# EAGLE board EBot4_v_12 (EAGLE 7.7.0)
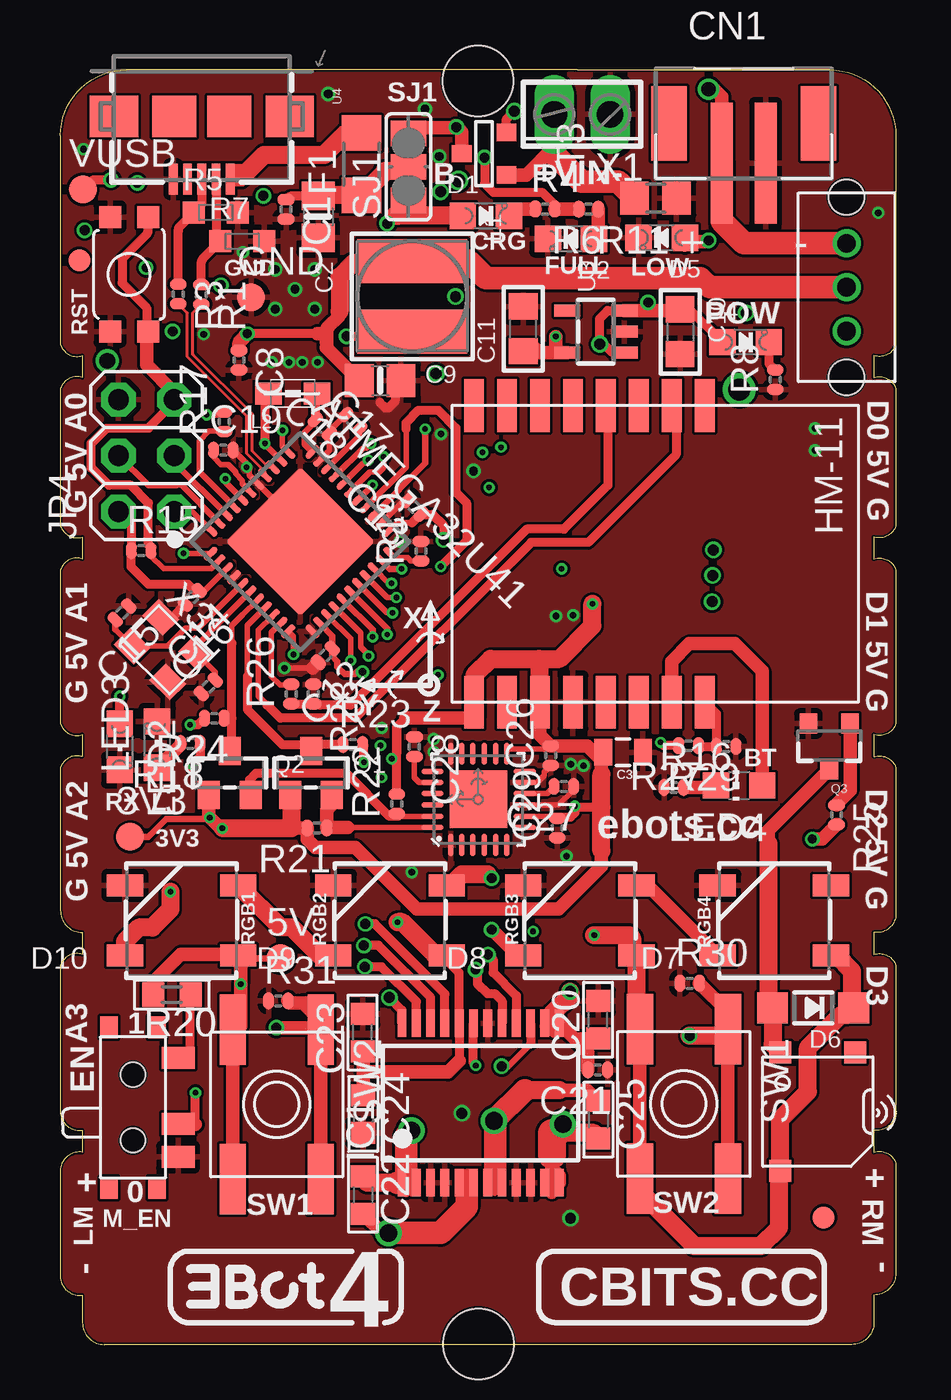
[diagram p4: board, top side]
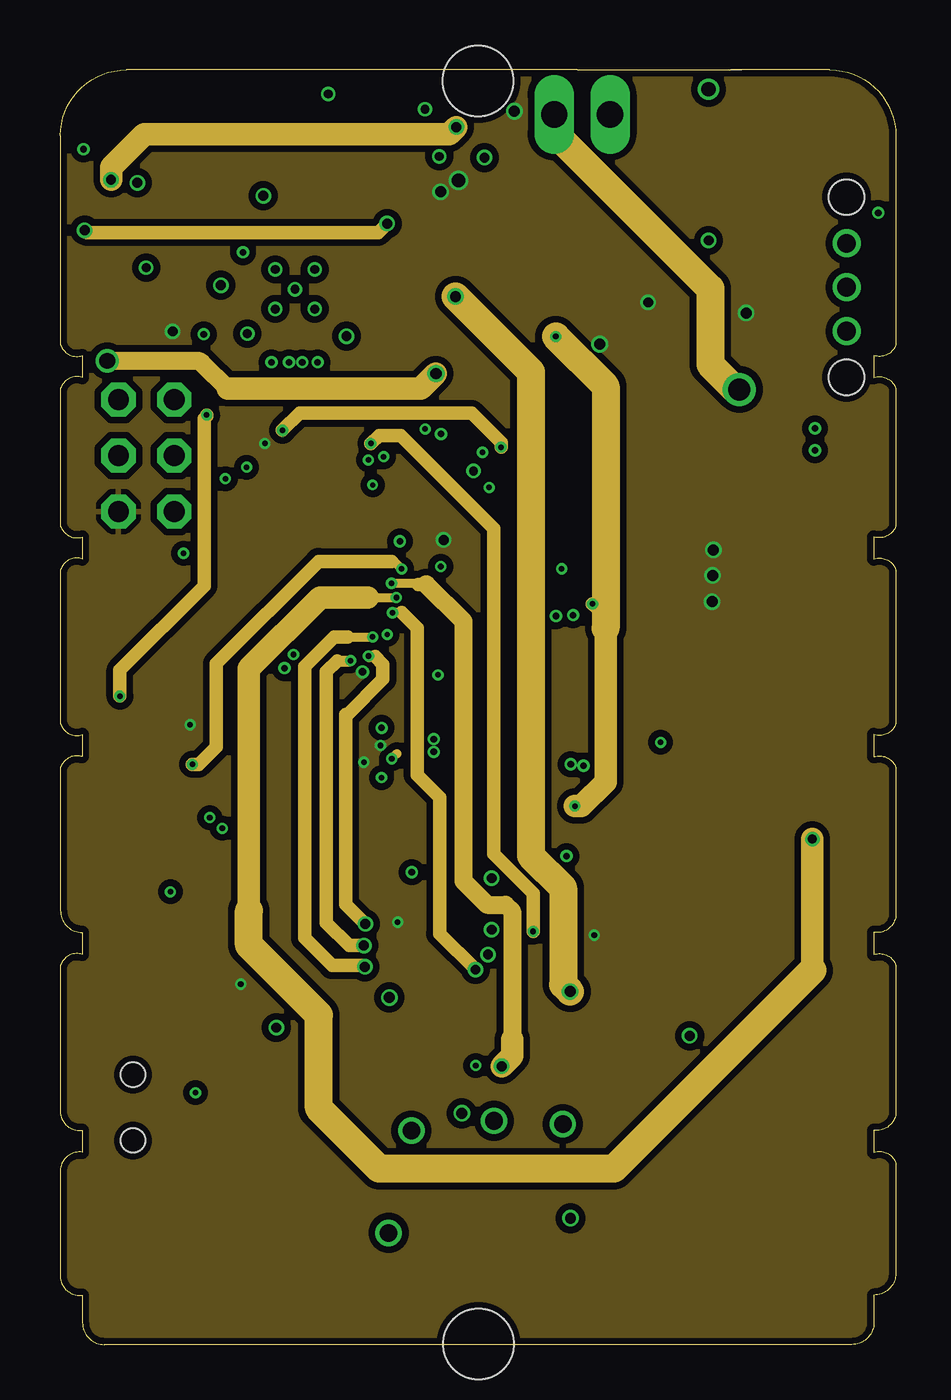
[diagram p5: board, inner layer Route2]
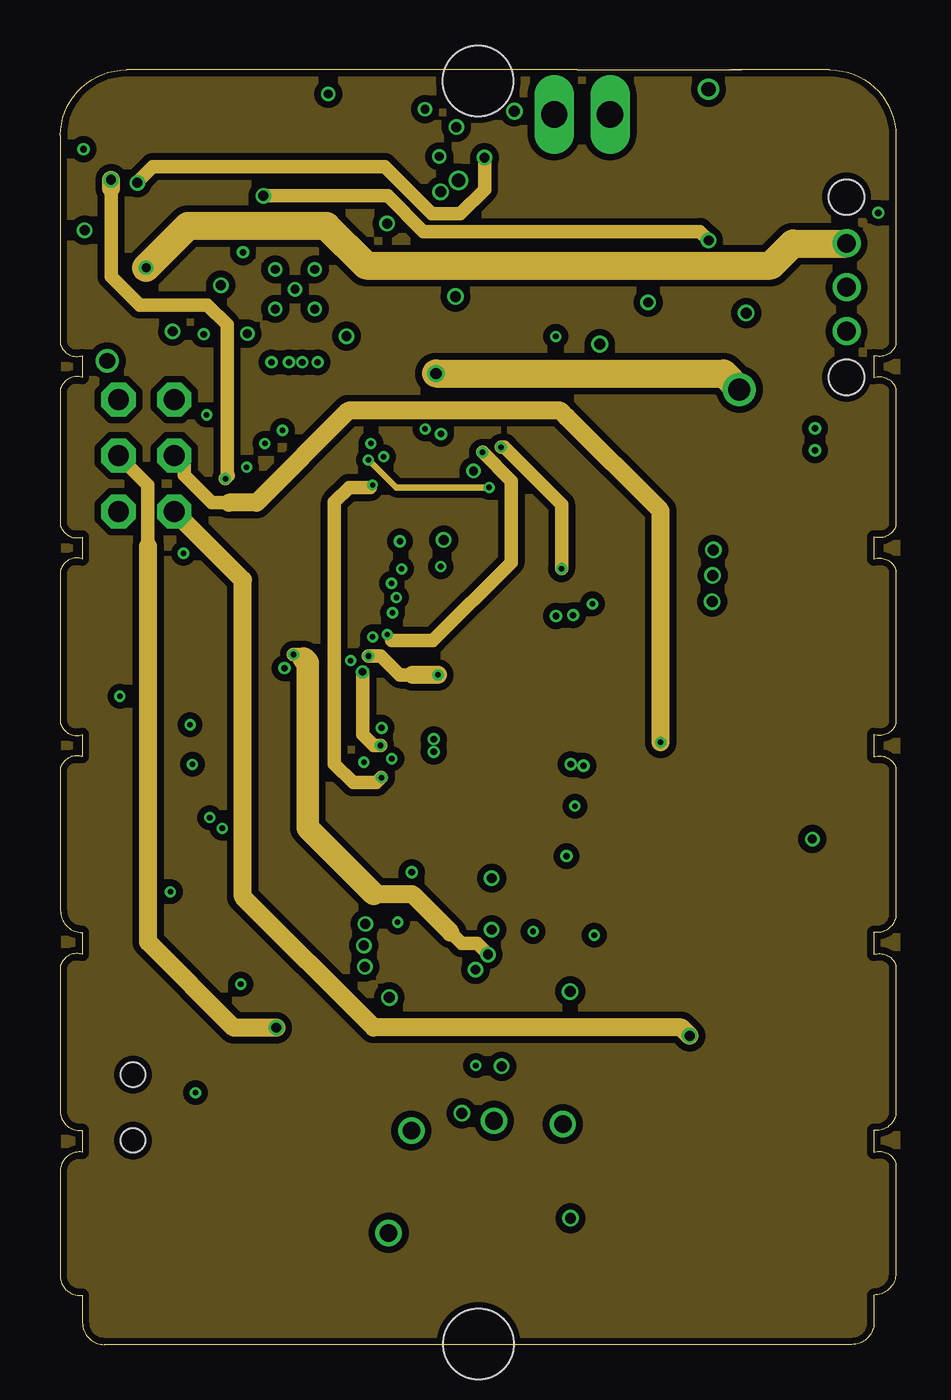
[diagram p6: board, inner layer Route15]
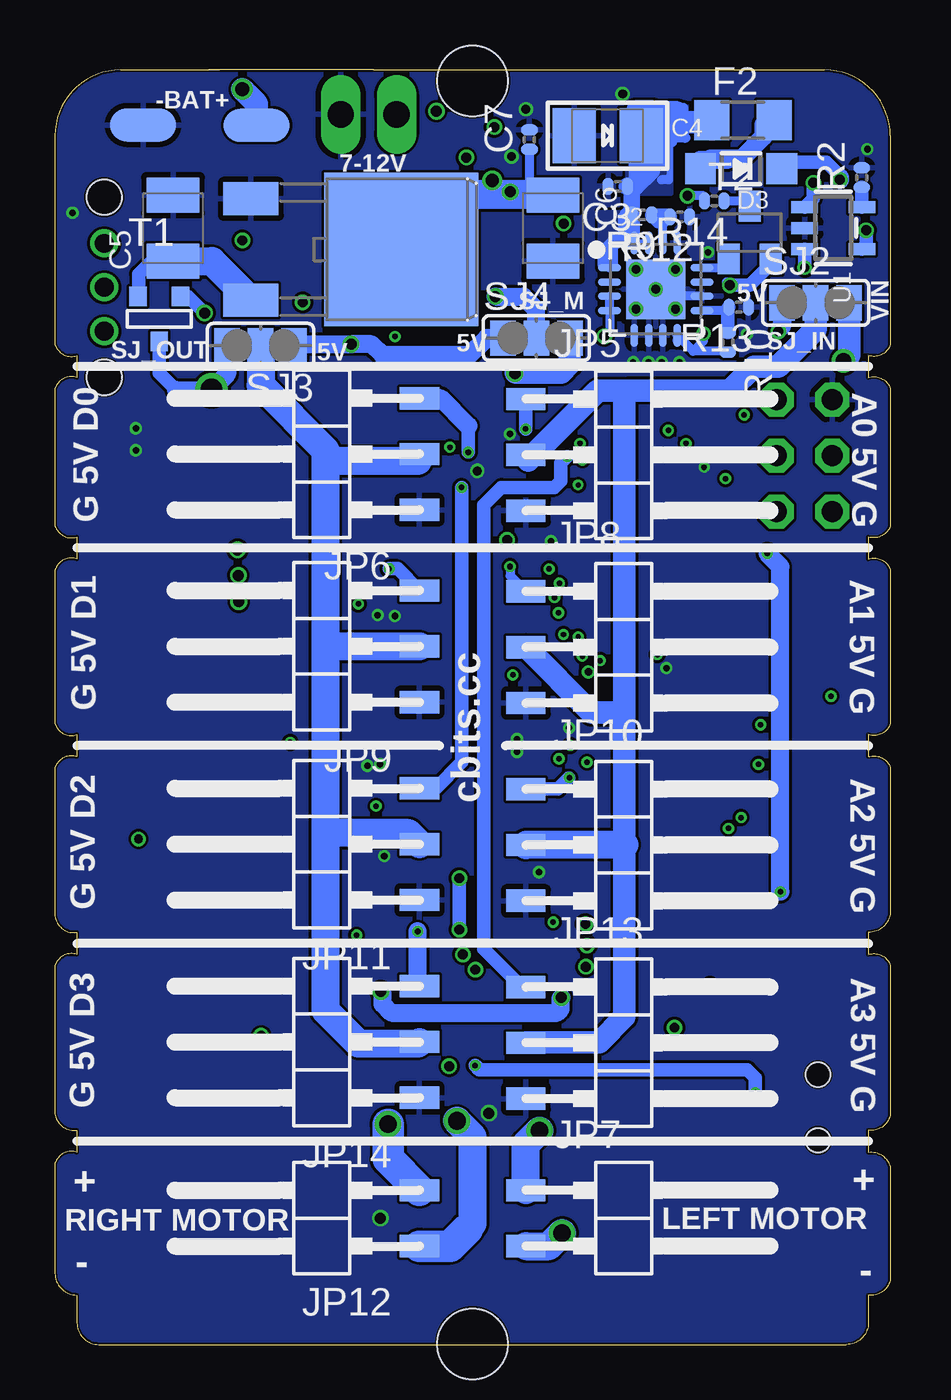
[diagram p7: board, bottom side, seen from below]

Size 38 x 58 mm. Coordinates in mm from the lower left corner, seen from the top.
Outline: 31,58 35,58 arc-90 38,55 38,45.5 arc-90 37,45 37,44 arc-90 38,43.5 38,37.25 arc-90 37,36.75 37,35.75 arc-90 38,35.25 38,28.25 arc-90 37,27.75 37,26.75 arc-90 38,26.25 38,19.5 arc-90 37,18.75 37,17.75 arc-90 38,17.25 38,10.5 arc-90 37,9.75 37,8.75 arc-90 38,8.25 38,3.25 arc-90 37,2.25 37,1 arc-90 36,0 2,0 arc-90 1,1 1,2.25 arc-90 0,3 0,8 arc-90 1,8.75 1,9.75 arc-90 0,10.5 0,17.25 arc-90 1,17.75 1,18.75 arc-90 0,19.75 0,26.25 arc-90 1,26.75 1,27.75 arc-90 0,28.25 0,35.25 arc-90 1,35.75 1,36.75 arc-90 0,37.25 0,43.5 arc-90 1,44 1,45 arc-90 0,45.5 0,55 arc-90 3,58 23.5,58 31,58
Outline: 31,58 30.5,58
Copper layers (1*2*15*16): Top 0.035559375mm / dielectric 0.47751875mm / Route2 0.035559375mm / dielectric 0.47751875mm / Route15 0.035559375mm / dielectric 0.47751875mm / Bottom 0.035559375mm
Design rules "SparkFun-4-layer-FAB-LIMIT *": minimum track width 4mil, minimum drill 6mil, track to track 5mil, track to pad 5mil, pad to pad 5mil, via to via 5mil, smd to smd 5mil, copper to edge 4mil, drill to drill 4mil, minimum pad ring 5mil, minimum via ring 5mil, stop-mask expansion 4mil, vias tented up to drill 21mil, thermal gap 10mil
Holes 3.2 mm at 19,57.5 19.01,0.03

## Footprints (pad centres in the part's own frame; a part is rotated, then mirrored left to right if it is on the bottom)
B1,27 = smd 1.27 x 1.27: TP 0,0
QFN44ML7X7 = smd 0.75 x 0.275: 1 -3.275,2.5; 2 -3.275,2; 3 -3.275,1.5; 4 -3.275,1; 5 -3.275,0.5; 6 -3.275,0; 7 -3.275,-0.5; 8 -3.275,-1; 9 -3.275,-1.5; 10 -3.275,-2; 11 -3.275,-2.5; 23 3.275,-2.5; 24 3.275,-2; 25 3.275,-1.5; 26 3.275,-1; 27 3.275,-0.5; 28 3.275,0; 29 3.275,0.5; 30 3.275,1; 31 3.275,1.5; 32 3.275,2; 33 3.275,2.5 | smd 0.275 x 0.75: 12 -2.5,-3.275; 13 -2,-3.275; 14 -1.5,-3.275; 15 -1,-3.275; 16 -0.5,-3.275; 17 0,-3.275; 18 0.5,-3.275; 19 1,-3.275; 20 1.5,-3.275; 21 2,-3.275; 22 2.5,-3.275; 34 2.5,3.275; 35 2,3.275; 36 1.5,3.275; 37 1,3.275; 38 0.5,3.275; 39 0,3.275; 40 -0.5,3.275; 41 -1,3.275; 42 -1.5,3.275; 43 -2,3.275; 44 -2.5,3.275 | smd 4.826 x 4.826: EXP 0,0
AZ1084C = smd 1.5 x 2.5: GND -2.3,-6.85; VIN 2.3,-6.85 | smd 7 x 7: VOUT 0,0
C0402 = smd 0.508 x 0.762: 1 -0.445,0; 2 0.445,0
0805-NO = smd 1.3 x 1.5: 1 -0.95,0; 2 0.95,0
EIA3528-21/B-R = smd 1.95 x 2.5: + 1.525,0; - -1.525,0
SMC_B = smd 1.6 x 2.4: + -1.5,0; - 1.5,0
_0805 = smd 1.2 x 1.3: 1 -1.016,0; 2 1.016,0
C0603 = smd 1 x 1.1: 1 -0.85,0; 2 0.85,0
0805 = smd 0.8 x 1.2: 1 -0.9,0; 2 0.9,0
JST-PH-2-SMT = smd 1 x 5.5: 1 -1,-1.8; 2 1,-1.8 | smd 1.6 x 3.4: NC1 -3.4,0; NC2 3.4,0
CHIPLED_0805_NOOUTLINE = smd 1.2 x 1.2: A 0,-1.05; C 0,1.05
SOD-123 = smd 1.4 x 1.4: A 1.85,0; C -1.85,0
WS2812B = smd 1.651 x 1: 1 -2.577,1.6; 2 -2.577,-1.6; 3 2.577,-1.6; 4 2.577,1.6
R1206 = smd 1.6 x 1.803: 1 -1.422,0; 2 1.422,0
HM-11 = smd 2.4 x 0.9: GND 6.5,0; NC@5 -7,0; NC@6 -7,-1.5; NC@7 -7,-3; NC@8 -7,-4.5; NC@10 6.5,-3; PIO0 6.5,6; PIO1 6.5,4.5; PIO2 6.5,3; PIO3 6.5,1.5; RESETB 6.5,-1.5; UART_CTS -7,3; UART_RTS -7,6; UART_RX -7,1.5; UART_TX -7,4.5; VCC 6.5,-4.5
SSOP24 = smd 0.4 x 1.25: 1 -3.575,-3.625; 2 -2.925,-3.625; 3 -2.275,-3.625; 4 -1.625,-3.625; 5 -0.975,-3.625; 6 -0.325,-3.625; 7 0.325,-3.625; 8 0.975,-3.625; 9 1.625,-3.625; 10 2.275,-3.625; 11 2.925,-3.625; 12 3.575,-3.625; 13 3.575,3.625; 14 2.925,3.625; 15 2.275,3.625; 16 1.625,3.625; 17 0.975,3.625; 18 0.325,3.625; 19 -0.325,3.625; 20 -0.975,3.625; 21 -1.625,3.625; 22 -2.275,3.625; 23 -2.925,3.625; 24 -3.575,3.625
FIDUCIAL-1X2 = smd 1 x 1: 1 0,0
2X03 = drill 0.95 pad 1.55 octagon: 1 -2.54,-1.27; 2 -2.54,1.27; 3 0,-1.27; 4 0,1.27; 5 2.54,-1.27; 6 2.54,1.27
1X03SMD/90 = smd 1.016 x 1.778: 1 -1.27,-5.08; 2 1.27,-5.08; 3 3.81,-5.08
1X02SMD/90 = smd 1.016 x 1.778: 1 -1.27,-5.08; 2 1.27,-5.08
KMR7 = smd 1 x 1: P$1 -2.6,-0.865; P$2 2.6,-0.865; P$3 -2.6,0.865; P$4 2.6,0.865
INDUCTOR_5X5MM_TDK_VLC5045 = smd 2 x 5: P$1 -1.6,0; P$2 1.6,0
0805' = smd 1.2 x 1: 1 -1.1,0; 2 1.1,0
CHIPLED_0805 = smd 1.2 x 1.2: A 0,-1.05; C 0,1.05
CHIP-LED0805 = smd 1.2 x 1.2: A 0,-1.05; C 0,1.05
QFN-24-4MM2 = smd 1.016 x 0.254: 1 -2.066,1.257; 2 -2.066,0.75; 3 -2.066,0.247; 4 -2.066,-0.287; 5 -2.066,-0.792; 6 -2.066,-1.297; 13 2.086,-1.297; 14 2.086,-0.792; 15 2.086,-0.287; 16 2.086,0.247; 17 2.086,0.75; 18 2.086,1.257 | smd 0.254 x 1.016: 7 -1.267,-2.122; 8 -0.762,-2.122; 9 -0.258,-2.122; 10 0.278,-2.122; 11 0.78,-2.122; 12 1.287,-2.122; 19 1.287,2.082; 20 0.78,2.082; 21 0.278,2.082; 22 -0.258,2.082; 23 -0.762,2.082; 24 -1.267,2.082 | smd 2.616 x 2.616: P$1 0.02,-0.01
OS102011MA1QN1 = drill 0.85: P$1 -2,0; P$2 0,0; P$3 2,0 | hole 1.6: -4.1,0; 4.1,0
SOT23-WIDE@1 = smd 1 x 1.27: 1 -0.95,-1; 2 0.95,-1; 3 0,1
SOT23-3 = smd 0.8 x 0.9: 1 -0.95,-1; 2 0.95,-1; 3 0,1.1
R0402 = smd 0.508 x 0.762: 1 -0.445,0; 2 0.445,0
CT/CN0603 = smd 1 x 1: 1 -1,0; 2 1,0
R0805 = smd 1.3 x 1.5: 1 -0.95,0; 2 0.95,0
R0603 = smd 1 x 1.1: 1 -0.85,0; 2 0.85,0
SJ_2 = smd 1.168 x 1.6: 1 -1.524,0; 2 0,0; 3 1.524,0
SK-12C0405 = smd 1 x 1.5: L -2.25,2.05; M 0.75,2.05; R 2.25,2.05 | smd 1 x 0.8: P$1 -3.65,-1.1; P$2 -3.65,1.1; P$3 3.65,-1.1; P$4 3.65,1.1 | hole 1.1: -1.5,0; 1.5,0
SMT-0540-S-R = smd 1 x 1: + 1.7,-2.7; - 1.7,2.7; M -1.7,-2.7
EVQ-Q2 = smd 3.2 x 1.2: A -3.4,-2; A' 3.4,-2; B -3.4,2; B' 3.4,2
SOT-23 = smd 0.787 x 0.889: 1 0.025,-1.016; 2 -0.94,1.016; 3 0.991,1.016
SC59-BEC = smd 1 x 1.4: B -0.95,-1.2; C 0,1.2; E 0.95,-1.2
SOT23-5 = smd 0.55 x 1.2: 1 -0.95,-1.3; 2 0,-1.3; 3 0.95,-1.3; 4 0.95,1.3; 5 -0.95,1.3
PVQFN-16 = smd 1.05 x 0.35: 1 -2.1,0.975; 2 -2.1,0.325; 3 -2.1,-0.325; 4 -2.1,-0.975; 9 2.1,-0.975; 10 2.1,-0.325; 11 2.1,0.325; 12 2.1,0.975 | smd 0.35 x 1.05: 5 -0.975,-2.1; 6 -0.325,-2.1; 7 0.325,-2.1; 8 0.975,-2.1; 13 0.975,2.1; 14 0.325,2.1; 15 -0.325,2.1; 16 -0.975,2.1 | drill 0.4: P$18 0,0; P$19 -0.9,0.9; P$20 0.9,0.9; P$21 0.9,-0.9; P$22 -0.9,-0.9 | smd 2.7 x 2.7: THERMAL 0,0
SOT23-5@1 = smd 0.55 x 1.2: 1 -0.95,-1.3; 2 0,-1.3; 3 0.95,-1.3; 4 0.95,1.3; 5 -0.95,1.3
USB-AB-MICRO-SMD = smd 1.4 x 0.4: D+ 2.85,0; D- 2.85,0.65; GND 2.85,-1.3; ID 2.85,-0.65; VBUS 2.85,1.3 | smd 1.9 x 2: P$6 0,1.25; P$7 0,-1.25 | smd 1.9 x 2.2: P$8 0,4; P$9 0,-4
BATCON = smd 3 x 1.5: P$1 0,0
2POL254 = drill 1.2 long: 1 -1.27,0; 2 1.27,0
CRYSTAL-3.2-2.5 = smd 1.3 x 1.05: 1 -1.15,-0.925; 2 1.15,-0.925; 3 1.15,0.925; 4 -1.15,0.925

## Placement (x,y rotation side)
3V3  TPB1,27  [B1,27]  3.17,23.1 0 top
5V  TPB1,27  [B1,27]  10.02,17.58 0 top
ATMEGA32U41  ATMEGA32U4-XUMU  [QFN44ML7X7]  10.91,36.53 315 top
AZ1084C1  [AZ1084C]  22.24,49.83 270 bottom
C1  100n  [C0402]  10.26,51.65 270 top
C2  4.7µF  [0805-NO]  11.72,51.31 270 top
C3  2.2uF  [C0402]  12.4,52.7 180 bottom
C4  100uF/6V  [EIA3528-21/B-R]  12.86,55.01 0 bottom
C5  22u  [SMC_B]  32.63,50.8 90 bottom
C6  22u  [SMC_B]  15.35,50.8 270 bottom
C7  100n  [C0402]  16.42,54.83 90 bottom
C8  0.1uF  [C0402]  8.12,44.79 270 top
C9  10uF  [0805-NO]  14.54,43.86 0 top
C10  10µF  [_0805]  28.19,46.08 270 top
C11  10µF  [_0805]  21.05,46.22 90 top
C12  100n  [C0402]  12.05,31.36 225 top
C13  100n  [C0402]  16.1,38.1 135 top
C14  100n  [C0402]  6,34 225 top
C15  22pF  [C0402]  2.8,33.3 225 top
C16  22pF  [C0402]  6.73,29.93 45 top
C17  1uF  [C0402]  11.91,41.77 315 top
C18  100n  [C0402]  13.3,42 135 top
C19  1uF  [C0402]  7.41,40.7 0 top
C20  10uf  [C0603]  24.46,14.78 90 top
C21  0.1uF  [C0402]  24.44,12.5 180 top
C22  0.1u  [C0603]  13.76,6.81 270 top
C23  10uf  [C0603]  13.75,14.2 90 top
C24  0.1uf  [C0603]  13.77,10.49 270 top
C25  0.1u  [C0603]  24.46,10.23 270 top
C26  0.1uF  [C0402]  22.3,26.8 90 top
C27  0.1uF  [C0402]  22.9,25.4 180 top
C28  2.2nF  [C0402]  16.1,27.2 270 top
C29  10nF  [C0402]  22.6,23.5 90 top
C31  0.1uF  [0805]  25.59,26.95 180 top
CN1  [JST-PH-2-SMT]  31.08,55.56 0 top
D1  YELLOW  [CHIPLED_0805_NOOUTLINE]  19.35,51.36 270 top
D2  GREEN  [CHIPLED_0805_NOOUTLINE]  23.22,50.31 90 top
D3  MBR120  [SOD-123]  6.79,53.5 180 bottom
D4  red  [CHIPLED_0805_NOOUTLINE]  31.17,45.61 270 top
D5  RED  [CHIPLED_0805_NOOUTLINE]  27.35,50.36 90 top
D6  MBR120  [SOD-123]  34.24,15.32 180 top
D7  [WS2812B]  32.47,19.3 180 top
D8  [WS2812B]  23.63,19.3 180 top
D9  [WS2812B]  14.99,19.3 180 top
D10  [WS2812B]  5.51,19.3 180 top
EBOT_LOGO2  EBOT_NAME_6MM  [EBOT_NAME_6MM]  5.91,1.74 0 top
F1  500mA  [R1206]  13.69,53.71 90 top
F2  500mA  [R1206]  6.71,55.71 0 bottom
GND  TPB1,27  [B1,27]  8.67,47.65 0 top
HM-111  HM-11  [HM-11]  23.31,35.73 270 top
IC1  TB6612FNG  [SSOP24]  19.11,10.99 0 top
JP2  FIDUCIAL1X2  [FIDUCIAL-1X2]  0.86,49.34 90 top
JP3  FIDUCIAL1X2  [FIDUCIAL-1X2]  34.71,5.78 90 top
JP4  3x2M  [2X03]  3.91,40.45 90 top
JP5  [1X03SMD/90]  11.5,41.75 270 bottom
JP6  [1X03SMD/90]  26.5,39.25 90 bottom
JP7  [1X02SMD/90]  11.5,5.75 270 bottom
JP8  [1X03SMD/90]  11.5,33 270 bottom
JP9  [1X03SMD/90]  26.5,30.5 90 bottom
JP10  [1X03SMD/90]  11.5,24 270 bottom
JP11  [1X03SMD/90]  26.5,21.5 90 bottom
JP12  [1X02SMD/90]  26.5,5.75 90 bottom
JP13  [1X03SMD/90]  11.5,15 270 bottom
JP14  [1X03SMD/90]  26.5,12.5 90 bottom
KMR1  [KMR7]  3.12,48.7 270 top
L1  VLC5045-6.8uH  [INDUCTOR_5X5MM_TDK_VLC5045]  16,47.7 270 top
L2  MH2029-300Y  [0805']  10.57,43.27 0 top
LED2  yellow  [CHIPLED_0805]  2.7,27.2 180 top
LED3  BLUE  [CHIPLED_0805]  4.4,27.3 0 top
LED4  [CHIP-LED0805]  30.87,25.44 90 top
MPU-60501  MPU-6050-1  [QFN-24-4MM2]  19,24.8 90 top
ON_OFF_SLIDE1  OS102011MA1QN1  [OS102011MA1QN1]  35.76,48.11 90 top
Q1  BSS138  [SOT23-WIDE@1]  11.4,26 0 top
Q2  BSS138  [SOT23-WIDE@1]  7.7,26 0 top
Q3  2222A  [SOT23-3]  34.97,27.26 180 top
R1  22R  [R0402]  6.4,47.78 270 top
R2  2K  [R0402]  1.3,53.1 90 bottom
R3  22R  [R0402]  5.36,47.8 270 top
R4  470  [R0402]  22.04,51.67 0 top
R5  CG0603MLC-05E  [CT/CN0603]  7.07,51.51 0 top
R6  1K  [R0402]  24.02,51.66 180 top
R7  CG0603MLC-05E  [CT/CN0603]  8.27,50.2 0 top
R8  1k  [R0402]  32.52,43.9 90 top
R9  1.87M  [R0402]  11.3,51.4 180 bottom
R10  1.87M  [R0402]  7.4,45.6 270 bottom
R11  10k  [R0805]  27.07,52.16 180 top
R12  200K  [R0402]  9.58,51.31 180 bottom
R13  340K  [R0402]  6.9,47.2 180 bottom
R14  1k  [R0402]  8.01,52.04 180 bottom
R15  10K  [R0402]  3.67,36.13 0 top
R16  330  [R0402]  27.9,25.35 0 top
R17  1K  [R0402]  7.45,41.99 90 top
R18  1K  [R0402]  5.91,27.35 180 top
R19  10K  [R0402]  16.4,36.1 90 top
R20  10K  [R0603]  5.07,15.92 180 top
R21  10K  [R0402]  11.67,23.5 180 top
R22  10K  [R0402]  15.3,24.6 90 top
R23  10K  [R0402]  13.3,27.3 0 top
R24  10K  [R0402]  7,28.5 180 top
R25  270  [R0402]  35.3,24.1 270 top
R26  1K  [R0402]  10.5,29.6 90 top
R27  1K  [R0402]  28.57,27.25 180 top
R28  2K  [R0402]  11.5,29.6 270 top
R29  2K  [R0402]  30.28,27.22 180 top
R30  1K  [R0402]  28.62,16.44 0 top
R31  1K  [R0402]  9.91,15.64 0 top
SJ1  [SJ_2]  15.83,53.59 90 top
SJ2  [SJ_2]  3.4,47.4 0 bottom
SJ3  [SJ_2]  28.65,45.45 180 bottom
SJ4  [SJ_2]  16.1,45.8 0 bottom
SK-12C04051  SK-12C0405  [SK-12C0405]  3.3,10.79 270 top
SPK1  SMT-0540-S-R  [SMT-0540-S-R]  34.45,10.6 180 top
SW1  SPST_TACT-EVQQ2  [EVQ-Q2]  28.36,10.95 270 top
SW2  SPST_TACT-EVQQ2  [EVQ-Q2]  9.84,10.93 270 top
T1  PMV48XP  [SOT-23]  33.28,46.67 0 bottom
T2  MMUN2133LT1G  [SC59-BEC]  6.4,50.6 0 bottom
T3  FDN340P/PMV48XP  [SOT-23]  19.27,54.21 270 top
U1  MCP73831T-2ACI/OT  [SOT23-5]  2.6,50.8 270 bottom
U2  TPS61030RSAR  [PVQFN-16]  10.67,48.02 0 bottom
U3  RT9193  [SOT23-5@1]  24.35,46.09 90 top
U4  [USB-AB-MICRO-SMD]  6.43,55.88 270 top
U$1  BATCON  [BATCON]  28.83,55.48 0 bottom
U$2  BATCON  [BATCON]  33.99,55.49 180 bottom
VUSB  TPB1,27  [B1,27]  1.02,52.56 0 top
X1  [2POL254]  23.73,55.98 180 top
X3  16MHz KX-7  [CRYSTAL-3.2-2.5]  4.72,31.62 315 top

## Tracks (layer width: path | path; a pad name or v marks a point on that pad's centre or on a via)
+3V3  (via drill 0.25)
  Top 0.254: MPU-60501.13 20.3,27 20.4,27.1 22,27.1 22.26,27.1 | 22.25,27.2 C26.2 | 22.6,24 22.56,24.04 22.56,23.98 C29.2 | MPU-60501.8 22.51,24.04
  Top 0.3: 22.51,24.04 C29.2 | 22.6,24 22.7,23.9
  Top 0.305: 22.25,27.2 22.09,27.2 22,27.1 | C31.2 24.69,26.59 24.6,26.5 | 3V3.TP 3.99,23.1 4.81,23.92 6.73,23.92 v6.79,23.98
  Top 0.406: R22.2 15.3,28.1 | 15.7,28.5 15.3,28.1 | 22.6,24 23.2,24 23.4,24.2 v23.4,24.5 23.44,24.46 24.61,24.46 | 15.3,28.1 15.29,28.09 15.29,26.88 v15.07,26.66 | 7.4,23.5 7.27,23.5 7.27,23.49 7.28,23.49
  Top 0.61: v7.36,23.49 7.28,23.49 | HM-111.RESETB 21.81,27.73 C26.2 23.96,27.24 24.6,26.6 24.6,26.5 24.6,25.95 24.61,25.94 24.61,25.97 | 10.5,23.5 R21.2 11.23,22.98 11.6,22.61 13.41,22.61 16.2,19.82 22.67,19.82 24.61,21.76 24.61,22.47 | 15.7,28.5 18.75,28.5 | Q2.1 6.75,24.02 v6.79,23.98 7.27,23.5 | U3.5 22.5,45.14 | 22.5,45.14 21.78,45.14 21.56,45.36 21.21,45.36 C11.1 | v22.53,45.87 22.53,45.17 22.5,45.14
  Top 0.813: 21.76,31.2 19.57,31.2 18.83,30.46 18.83,29.25 HM-111.VCC 18.86,29.18 18.86,28.61 18.75,28.5 | 21.76,31.2 22.7,31.2 24.2,32.7 v24.2,33.7 | 7.4,23.5 10.5,23.5 10.5,24.95 Q1.1 | 24.61,22.47 24.61,24.46 24.61,25.94 | HM-111.RESETB 21.81,31.15 21.76,31.2
  Route2 0.406: v15.07,26.66 15.3,26.89
  Route2 0.61: v24.2,33.7 24.3,33.6 24.8,33.6
  Route2 1.016: 24.8,33.6 24.8,32.6 24.8,25.6 23.7,24.5 v23.4,24.5
  Route2 1.27: 24.8,32.6 24.8,43.6 v22.53,45.87
+5V  (via drill 0.25, 0.34, 0.45, 0.5, 0.6)
  Top 0.254: ATMEGA32U41.14 6.57,34.31 C14.1 | ATMEGA32U41.2 9.3,40.97 v9.3,41 | ATMEGA32U41.34 15.31,37.4 16,37.4 | R23.2 13.79,27.25
  Top 0.305: 9.3,43.1 9.39,43.1 | 8.2,14.49 8,14.49 SW2.A | SW1.A' 26.36,7.21 26.23,7.08 | ATMEGA32U41.24 12.36,32.25 C12.1 12.36,31.33 12.6,31.09 12.6,30.84 12.94,30.5 13.39,30.5 13.54,30.65 13.58,30.61 v13.74,30.61 | 5V.TP 8.34,17.58 arc-45 8.11,17.67 D10.1 | R20.2 4.22,16.47 arc-45 4.24,16.52
  Top 0.406: C14.1 6.09,34.31 5.8,34.6 4,34.6 3.2,35.4 3.2,36.1 R15.1 3.23,37.32 JP4.2 | 9.3,43.1 v9.3,41 | R24.2 6.25,28.2 v5.9,28.2 | 18.13,12.9 IC1.20 18.13,16.92 17.07,17.98 | 16.39,37.79 16.4,37.77 16.94,37.77 17.43,37.28 v17.43,36.61 | 16,37.4 16.39,37.79 | 16.39,37.79 C13.1 | v13.8,26.5 13.8,27.24 R23.2 | 17,17.77 17,17.92 17.07,17.98 | 17.07,17.98 17.28,17.98 D9.1 | D4.A 28.54,47.19 28.54,47.2 | U3.3 24.89,47.05 24.51,46.67 24.51,45.73 25.1,45.14 U3.1 | T3.2 20.29,55.76 v20.65,56.12
  Top 0.61: SW2.A SW2.A' | 8.2,14.49 v8.2,16.4 8.2,17.59 D10.1 8.03,17.76 5.48,17.76 4.24,16.52 | SW1.A SW1.A' | C23.1 13.77,13.33 13.77,12.4 | 13.77,12.4 C24.1 | 18.13,12.9 17.63,12.4 13.77,12.4 | 26.75,47.4 v26.73,47.42 26.73,47.06 26.75,47.04 | U3.3 26.75,47.04 | 26.75,47.04 27.91,47.04 27.97,47.1 C10.1 28.24,47.1 28.34,47.19 28.54,47.19 | 9.39,43.1 9.41,43.12 arc45 L2.1
  Top 0.813: 26.21,17.31 D8.1 | 26.21,13.9 26.21,14 | 26.21,14 D8.1 | 26.23,7.08 28.82,4.49 31.86,4.49 32.69,5.32 32.69,7.84 SPK1.- 32.75,10.25 34,11.5 34,13.5 35.5,15 35.77,15 D6.C 36.05,15.36 36,15.36 36,17 35.3,17.7 D7.1 | v24.28,18.63 25.87,18.63 26,18.5 26,17.91 D8.1 | 17,17.77 15.55,19.22 v15.34,19.22 | SW1.A 26.36,14.15 26.21,14
  Top 1.016: 8.21,17.58 D10.1
  Route15 0.61: v13.74,30.61 v13.75,30.6 13.75,27.75 14.24,27.26 v14.56,27.26
  Bottom 0.305: 17.67,52.22 17.75,52.3
  Bottom 0.406: 19.86,52.3 20.2,51.96 | SJ3.1 27.06,45.52 | C7.1 16.42,52.76 16.14,52.48 | 17.64,52.41 17.75,52.3 | v17.29,52.45 17.72,52.45 17.75,52.48
  Bottom 0.61: v5.1,46.1 5.1,46.32 4.92,46.5 | T1.3 31.94,47.69 v31.19,46.94 | 20.2,51.96 22.24,49.92 AZ1084C1.VOUT
  Bottom 0.813: SJ2.1 4.92,46.5 4.92,46.32 | 27.06,45.52 v24.53,45.52 23.61,45.52 23.1,45.01 19.16,45.01 18.37,45.8 SJ4.1 18.27,45.8
  Bottom 1.016: 17.75,52.3 16.05,52.3 16,52.25 | 20.2,51.96 19.49,51.96 18.97,52.48 17.75,52.48 16.14,52.48 16.05,52.48 15.94,52.37
  Bottom 1.27: C6.+ 17.75,52.3 19.86,52.3
  other vias: 29.64,33.8 29.66,35 29.7,36.16 18.11,52.97
  pour Route2 (isolate 0.305): -4,67 44,67 44,-2 -4,-2
A0  (via drill 0.25)
  Top 0.254: ATMEGA32U41.36 16.6,40.1
  Top 0.305: 16.6,40.1 16.59,40.11 v16.59,41.66
  Bottom 0.61: v16.59,41.66 JP5.1
A1  (via drill 0.25)
  Top 0.254: ATMEGA32U41.37 15.72,39.93 15.72,41.66
  Top 0.406: v17.3,35.4 18.48,36.58 18.48,38.3 17.99,38.79 17.99,41.71 17.19,42.51 16.28,42.51 15.72,41.95 15.72,41.66
  Bottom 0.406: v17.3,35.4 17.3,34.99 JP8.1
A2  (via drill 0.23, 0.25)
  Top 0.254: ATMEGA32U41.38 v14.2,39.11
  Route15 0.305: v14.2,39.11 v14.2,39.1 14.1,39
  Route15 0.61: v14.6,25.8 14.37,25.57 13.31,25.57 12.46,26.42 12.46,38.33 13.13,39 14.1,39
  Bottom 0.406: 14.63,25.77 v14.6,25.8
  Bottom 0.61: 14.63,25.77 15.13,25.27 JP10.1
A3  (via drill 0.24)
  Top 0.254: ATMEGA32U41.39 13.98,39.6 14.07,39.69 14.5,39.69 14.69,39.88 v14.69,40.39 v14.7,40.4 14.7,40
  Bottom 0.61: v14.7,40.4 15,40.1 15,39.3 15.3,39 17.7,39 18.5,38.2 18.5,18 16.77,16.27 JP13.1
A4  (via drill 0.25)
  Top 0.254: ATMEGA32U41.40 13.77,40.1 13.86,40.1 v14.01,40.25
  Route15 0.305: v14.01,40.25 v14.02,40.25 15.27,39 v19.5,39
  Bottom 0.61: v19.5,39 19.5,26.5 20.69,25.31 JP11.3
A5  (via drill 0.25)
  Top 0.254: ATMEGA32U41.41 13.76,40.8 13.92,40.8 v14.12,41
  Route2 0.61: v21.5,18.8 21.5,20.53 19.71,22.32 19.71,37.13 15.47,41.37 14.49,41.37 v14.12,41
  Bottom 0.813: v21.5,18.8 21.5,16.39 JP14.3
AO1'  (via drill 0.8)
  Top 0.254: IC1.1 15.57,7.4 15.57,7.81 15.58,7.82 15.74,7.82 15.71,7.79 15.71,6.85 | 15.98,6.86 15.98,7 15.98,7.88
  Top 0.305: IC1.2 15.98,7.16 15.98,7 | 15.98,7.88 15.97,7.89 15.83,7.89 15.81,7.91 15.74,7.91 | 15.71,6.85 15.76,6.85 | 15.74,7.82 15.74,7.91 | 15.74,7.91 15.83,8 | 13.95,7.37 13.95,7.47 C22.1
  Top 0.813: 15.31,7.37 13.95,7.37
  Top 1.016: 15.31,7.37 IC1.1 | 15.74,7.91 15.74,9.52 v15.96,9.74
  Bottom 1.27: JP7.1 16.58,9.12 v15.96,9.74
AO2'  (via drill 0.8)
  Top 0.305: 18.48,7.79 18.51,7.79 18.52,7.8
  Top 0.406: IC1.5 18.17,7.37 18.17,7.79 18.48,7.79 | 18.47,6.92 18.52,6.92 18.52,7.8 18.79,7.8 IC1.6 | 18.29,6.92 18.47,6.92 | 18.47,6.92 18.47,7.15
  Top 0.61: 14.89,5.08 14.64,5.08 C22.2
  Top 1.016: 18.47,7.15 18.47,6.26 17.29,5.08 v14.93,5.08 14.89,5.08
  Bottom 1.27: JP7.2 15.53,4.48 v14.93,5.08
AREF
  Top 0.254: ATMEGA32U41.42 13.61,41.36 C18.1
AVCC
  Top 0.254: ATMEGA32U41.44 11.1,40.98 11.1,41.5 11.6,42 C17.1
  Top 0.305: 11.6,43.2 L2.2
  Top 0.406: 11.6,43.2 C17.1
BLE_KEY
  Top 0.406: 29.42,29.12 29.84,28.7 R29.2 29.04,27.22 R27.1
  Top 0.61: 29.42,29.12 HM-111.PIO0
BLE_LED
  Top 0.61: HM-111.PIO1 27.81,31.09 28.61,31.89 30.67,31.89 31.92,30.64 LED4.A
BO1'  (via drill 0.8)
  Top 0.406: 22.35,9.61 22.35,8.63 22.35,8.5 22.35,7.99 | 22.36,6.93 22.04,7.25 IC1.11
  Top 0.61: 24.28,9.63 24.28,9.54 24.3,9.54 C25.2 | 22.36,6.93 22.36,8 | 22.36,8 22.36,8.49 22.35,8.5 | IC1.12 22.68,7.67 22.36,8
  Top 0.813: 24.28,9.63 22.75,9.63 22.35,9.63
  Top 1.016: v22.85,10.03 22.85,9.73 22.75,9.63
  Top 1.27: 22.35,9.63 22.35,8.63
  Bottom 1.422: v22.85,10.03 22.85,8.45 JP12.2
BO2'  (via drill 0.8)
  Top 0.305: 19.77,6.99 19.43,7.33 IC1.7 IC1.8 20.09,7.22 19.76,6.9 19.76,7.84 19.77,7.85
  Top 0.61: 22.69,11.57 23.97,11.57 C25.1
  Top 0.813: 22.69,11.57 21.15,11.57
  Top 1.016: 21.15,11.57 21.11,11.57 v19.72,10.18 19.77,10.13 19.77,7.85
  Bottom 1.27: 19.25,5.25 19,5.5 19,9.46 v19.72,10.18
  Bottom 1.422: JP12.1 20.02,4.48 19.25,5.25
D0/RX
  Top 0.254: ATMEGA32U41.20 9,32.5 9,29.5 9.4,29.1
  Top 0.406: 9.4,29.1 10,28.5 13.41,28.5 21.41,36.5 24,36.5 28,40.5 28,42.54 HM-111.UART_TX
D1/TX
  Top 0.254: ATMEGA32U41.21 9.6,32.4 9.6,30.4 10,30 10.46,30 R26.2
D4/M1  (via drill 0.25, 0.45)
  Top 0.254: ATMEGA32U41.25 13.2,32.12 v13.2,31.12
  Top 0.406: IC1.22 16.84,15.79 14.46,18.17 14.45,18.16 v13.8,18.16
  Route2 0.406: v13.2,31.12 12.6,31.12 12.59,31.11
  Route2 0.5: 12.59,31.11 v13.19,31.11
  Route2 0.61: v13.8,18.16 13.13,18.16 12.1,19.19 12.1,30.62 12.59,31.11
D5*/PWM2  (via drill 0.25, 0.45)
  Top 0.254: ATMEGA32U41.31 14.96,34.6 15.03,34.6
  Top 0.305: 15.03,34.6 v15.06,34.63 v15.06,34.64 | 21.39,13.68 20.37,12.66 v20.07,12.66
  Top 0.406: IC1.15 21.39,13.68
  Route2 0.406: 16.27,34.59 16.26,34.6 16.25,34.59 16.2,34.64 v15.06,34.64
  Route2 0.61: 16.62,34.59 16.27,34.59 | 20.54,14.02 20.54,13.89
  Route2 0.813: 16.62,34.59 16.65,34.59 18.34,32.9 18.34,21.08 19.41,20.01 20.25,20.01 20.54,19.72 20.54,14.02
  Route2 1.016: 20.54,13.89 20.54,13.13 v20.07,12.66
D6*/PWM1  (via drill 0.24, 0.45)
  Top 0.254: ATMEGA32U41.27 14.21,32.53
  Top 0.305: 14.21,32.53 14.2,32.52 v14.2,32.2
  Top 0.406: IC1.23 16.18,15.61 14.6,17.19 v13.85,17.19
  Route2 0.406: 13.06,32.2 v14.2,32.2 | 13.79,17.25 v13.85,17.19
  Route2 0.61: 13.06,32.2 12.46,32.2 11.11,30.85 11.11,18.5 12.36,17.25 13.79,17.25
D7  (via drill 0.25)
  Top 0.254: ATMEGA32U41.1 10.1,40.88 v10.1,41.6
  Route2 0.61: v10.1,41.6 10.88,42.38 18.7,42.38 20.04,41.04 v20.04,40.83
  Route15 0.406: v20.04,40.83 v20.04,40.84
  Route15 0.61: v22.8,35.3 22.8,38.23 20.19,40.84 20.18,40.83 v20.04,40.83
  Bottom 0.61: JP9.3 22.41,35.3 v22.8,35.3
D+
  Top 0.406: U4.D+ 6.43,52 arc-45 6.34,51.78 R5.1 5.45,50.89 arc45 5.36,50.67 R3.1
D-
  Top 0.305: 7.08,50.52 7.12,50.52 arc45 7.19,50.55
  Top 0.406: 7.08,50.55 7.19,50.55 | U4.D- 7.08,50.52 arc45 7.17,50.3 R7.1 6.49,49.42 arc45 6.4,49.2 R1.1
GND  (via drill 0.25, 0.3, 0.4, 0.5)
  Top 0.254: ATMEGA32U41.43 12.23,40.68 C17.2 12.23,41.55 C18.2 | ATMEGA32U41.35 15.62,38.41 C13.2 | MPU-60501.9 22.64,24.54 23.34,25.24 C27.1 | MPU-60501.11 21.68,25.58 22,25.9 22,26.05 C26.1 | ATMEGA32U41.EXP 10.91,37.24 ATMEGA32U41.5 8.59,39.56 8.59,39.97 C19.2 | v10.19,30.78 11.47,30.78
  Top 0.305: R28.1 11.47,30.07
  Top 0.406: C14.2 5.08,33.08 X3.4 | 15.22,43.49 15.22,42.92 14.93,42.63 14.77,42.63 14.53,42.87 | 12.99,42.34 C18.2
  Top 0.61: 11.47,30.78 C12.2 | 26.6,50.36 D5.C
  Bottom 0.254: JP8.3
  Bottom 0.406: U2.10 9.6,47.7 9.77,47.53 U2.P$21
  other vias: 9.6,44.7 10.4,44.7 11,44.7 11.7,44.7 8.3,49.7 12.18,56.9 37.2,51.5 1.05,54.39 6.52,45.97 8.47,39.92 15.44,36.55 17.31,41.43 14.61,28.06 16.98,26.97 23.32,33.19 16.98,27.55 22.54,33.15 23.02,22.23 23.21,26.41 23.79,26.34 15.98,21.49 18.26,10.53 23.2,5.75 34.32,41.69 34.32,40.69 16.58,56.21 17.23,54.06 18.79,39.75
  pour Top: -2,65 41,59.5 42,-1 -2,-1
  pour Bottom (rank 2): -8,71 48,71 48,-6 -8,-6
HWB
  Top 0.254: ATMEGA32U41.33 15.18,35.8 15.8,35.8 15.94,35.66 R19.1
IO8  (via drill 0.24, 0.25)
  Top 0.254: ATMEGA32U41.28 14.85,32.59
  Top 0.305: 14.85,32.59 14.87,32.57 v14.87,32.31
  Route15 0.406: 15.07,32.03 15.07,32.11 v14.87,32.31
  Route15 0.61: 15.07,32.03 16.94,32.03 20.5,35.59 20.5,39.3 v19.2,40.6
  Bottom 0.61: 19.2,41.8 v19.2,40.6
  Bottom 0.813: 19.2,41.8 20.46,43.06 JP6.3
IO9*/M3  (via drill 0.25, 0.45)
  Top 0.254: ATMEGA32U41.29 14.85,33.3 v15.1,33.3
  Top 0.305: v18.88,17.06 18.91,17.03 18.97,17.03
  Top 0.406: 18.97,17.03 18.97,16.43 19.43,15.97 19.75,15.97 20.09,15.63 IC1.17
  Route2 0.406: 15.53,33.3 v15.1,33.3
  Route2 0.61: 15.53,33.3 16.22,32.61 16.22,25.92 17.25,24.89 17.25,18.69 v18.88,17.06
IO10*  (via drill 0.25, 0.4)
  Top 0.254: ATMEGA32U41.30 14.86,34 v15.27,34 v15.28,33.99
  Top 0.61: R25.2 34.65,23 v34.2,23
  Route2 0.406: 13.98,34 v15.27,34 v15.28,33.99
  Route2 1.016: 13.98,34 11.81,34 8.57,30.76 8.57,19.75 8.57,18.77 | 34.2,17.03 v34.2,23
  Route2 1.27: 34.2,17.03 25.17,8 14.5,8 11.75,10.75 11.75,15 8.57,18.18 8.57,19.75
IO11*/RGB  (via drill 0.25)
  Top 0.254: ATMEGA32U41.12 6.81,36 v5.6,36
  Top 0.813: v5,20.6 5,19.8 4.18,18.98 3.57,18.98 2.93,18.34 D10.4
  Bottom 0.813: v5,20.6 5,35.4 v5.6,36
IO12*/M4  (via drill 0.25, 0.45)
  Top 0.254: 14,31.4 13.65,31.75 13.65,32.38 ATMEGA32U41.26
  Top 0.305: 14,31.4 v14,31.34 v14.01,31.33
  Top 0.406: IC1.21 17.48,15.96 14.3,19.14 v13.87,19.14
  Route2 0.5: 14.32,31.3 14.04,31.3 v14.01,31.33
  Route2 0.61: v13.87,19.14 12.98,20.03 12.98,28.67 13.06,28.67 14.67,30.28 14.67,30.95 14.32,31.3
  Route15 0.61: v14.01,31.33 14.58,31.33 15.44,30.47 16.02,30.47
  Route15 0.813: v17.17,30.47 16.02,30.47
IO13*  (via drill 0.25)
  Top 0.305: ATMEGA32U41.32 14.98,35.29 v15.52,35.29
  Top 0.406: 6,26.2 v6,26.4 6.35,26.75 R18.1
  Route2 0.406: 15.07,35.63 15.18,35.63 v15.52,35.29
  Route2 0.61: 15.07,35.63 11.74,35.63 7.09,30.98 7.09,27.2 6.29,26.4 v6,26.4
LBI
  Bottom 0.406: R13.2 7.5,47.05 | 7.5,47.05 U2.9 | 7.5,47.05 7.4,46.95
  Bottom 0.61: R10.1 7.4,47.15 R13.2
LBO
  Bottom 0.406: U2.12 7.75,48.99 T2.B
M2  (via drill 0.25, 0.45)
  Top 0.254: ATMEGA32U41.22 10.6,32.21 v10.6,31.4
  Top 0.406: v19.45,17.75 19.68,17.52 19.68,16.93 20.73,15.88 IC1.16
  Route15 0.61: 17.75,18.75 18.25,18.25 18.95,18.25 v19.45,17.75 | v10.6,31.4 10.89,31.4 11.07,31.21
  Route15 0.813: 14.25,20.5 16,20.5 17.75,18.75
  Route15 1.016: 14.25,20.5 11.25,23.5 11.25,31.04 11.07,31.21
MISO  (via drill 0.45)
  Top 0.254: ATMEGA32U41.11 6,37.91 JP4.1
  Top 0.305: 30.39,14.54 30.36,14.51 SW1.B 30.39,14.38 30.39,15.11
  Top 0.61: SW1.B SW1.B' | 30.37,15.13 R30.2 30.39,15.11 | 30.39,14.54 29.9,14.05
  Top 0.813: 29.9,14.05 v28.62,14.05
  Route15 0.813: v28.62,14.05 28.24,14.43 14.24,14.43 8.3,20.37 8.3,34.79 JP4.1
MOSI  (via drill 0.45)
  Top 0.254: 5.3,39.1 5.51,39.1 ATMEGA32U41.10
  Top 0.3: JP4.4 3.99,39.1 5.3,39.1
  Top 0.61: SW2.B' SW2.B 11.84,14.73 11.02,15.55 | 11.02,15.55 10.44,15.55 R31.2 10.33,15.66 | 11.02,15.55 11.26,15.55 11.76,15.05 11.76,14.4 9.84,14.4 v9.82,14.42
  Route15 0.61: 3.99,36.33 3.98,36.34 3.98,39.11 JP4.4
  Route15 0.813: v9.82,14.42 7.89,14.42 3.99,18.32 3.99,36.33
  Bottom 0.61: v9.82,14.42 v9.82,14.43
N$1  (via drill 0.45)
  Top 0.61: SJ1.1 14.86,51.1 v14.86,51.01 15.25,51.4
  Top 0.813: D1.A 15.35,51.36 arc-45 15.25,51.4
  Route2 0.61: v1.1,50.7 1.2,50.6 14.45,50.6 v14.86,51.01
  Bottom 0.61: v1.1,50.7 1.1,50.05 U1.4
N$2  (via drill 0.25)
  Top 0.254: v6.65,42.3 7.25,42.3 7.38,42.43 R17.2
  Top 0.406: LED2.A v2.7,29.5
  Route2 0.61: v2.7,29.5 2.7,30.69 6.53,34.52 6.53,42.13 6.65,42.25 v6.65,42.3
N$3  (via drill 0.4)
  Top 0.406: 12.1,45.61 12.09,45.6 | 11.69,46 v8.5,46
  Top 0.61: 12.09,45.36 12.12,45.34 | 12.12,45.34 C9.1 | 12.7,47 12.7,46.96 arc-45 12.61,46.74 12.21,46.34 arc45 12.12,46.11 12.12,46 | 12.12,45.65 12.12,45.34 | 12.1,45.61 arc45 12.12,45.65 | 12.12,45.65 12.12,46 | 11.69,46 12.12,46 | C8.1 8.12,45.49 arc-45 8.21,45.71 v8.5,46
  Top 0.813: 12.7,47 12.7,48.6 13.3,49.2 16.4,49.2 16.3,49.3 L1.P$1 16.17,49.13 16.67,49.13
  Top 1.016: ON_OFF_SLIDE1.P$2 29.53,48.11 29.11,48.53 19.34,48.53 18.56,49.31 17.23,49.31 16.86,48.94 16.67,49.13
  Bottom 0.406: 9.7,45.7 U2.8 8.97,45.2 | R10.2 7.44,45.2 8.97,45.2 | 8.97,45.2 8.5,45.67 v8.5,46
N$4
  Top 0.406: R18.2 5.46,27.32
  Top 0.6: 5.46,27.32 LED3.A
N$5
  Top 0.813: D10.2 9.99,19 10.5,19 11.8,17.7 D9.4
N$6
  pour Route15 (isolate 0.305): 19,58 35.5,58 arc-95 38,55.25 38,2.75 37,2.25 37,1 36.5,0.25 1.75,0.25 1,1 1,2.25 0.25,2.75 0.25,40.25 0.25,55.5 1,57 3,58
N$7
  Top 0.61: R4.1 20.84,51.67 arc45 20.62,51.58 D1.C
  Top 0.813: 20.43,51.57 20.43,51.43 arc-45 D1.C
N$8  (via drill 0.45)
  Top 0.61: 19.43,21.4 v19.61,21.22 | D8.4 20.79,17.7 v19.61,18.88
  Top 0.813: 19.43,21.4 18.26,21.4 17.76,20.9 D9.2
  Bottom 0.61: v19.61,21.22 v19.61,18.88
N$9
  Top 0.406: R26.1 R28.2 11.74,29.16 11.8,29.1 13.2,29.1 21.2,37.1 22.9,37.1 24.9,39.1 24.9,42.64 HM-111.UART_RX
N$10
  Bottom 0.61: JP5.2 16.45,40.35 16.35,40.35
  Bottom 1.016: SJ2.2 3.4,46.2 5.1,44.5 6.2,44.5 7.3,43.4 12,43.4 | 12.1,28.76 12.1,43.3 12,43.4 | 12.1,28.76 12.1,22.75 12.1,14.9 13.25,13.75 16.56,13.75 JP13.2 | 16.13,31.73 JP8.2 13.6,28.76 12.1,28.76 | 16.47,40.23 16.35,40.35 13.3,43.4 12,43.4
  Bottom 1.27: JP10.2 16.56,22.75 12.1,22.75
N$11
  Top 0.254: C28.2 16.1,25.8 16.32,25.58 MPU-60501.20
N$12
  Top 0.254: MPU-60501.10 22.13,25.08 C27.2
N$13
  Top 0.61: D8.2 26.71,20.9 29.41,18.2 29.41,18.19 D7.4
N$14
  Top 0.61: R16.2 29.73,25.35 LED4.C
N$15  (via drill 0.45)
  Top 0.305: 22.41,51.92 22.41,51.84 arc45 R4.2
  Top 0.406: v19.29,54.01 19.29,52.83 19.69,52.43 21.91,52.43 22.41,51.92
  Top 0.61: R4.2 23.55,51.67 arc-45 R6.2
  Route15 0.61: v3.5,52.86 3.5,52.9 4.2,53.6 14.75,53.6 16.9,51.45 18.18,51.45 19.29,52.56 v19.29,54.01 19.29,53.94
  Bottom 0.61: v3.5,52.86 3.5,52.15 U1.1
N$16
  Bottom 0.61: R2.1 U1.5 | U1.5
N$17
  Top 0.61: R6.1 24.46,50.64 arc-45 24.37,50.41 D2.A
N$18  (via drill 0.45)
  Top 0.406: v13.01,45.88 15.78,45.88 L1.P$2
  Bottom 0.406: U2.3 U2.4 12.77,46.12 v13.01,45.88
N$19
  Top 0.406: D4.C 32.22,44.65 R8.2
N$20  (via drill 0.45)
  Top 0.61: 28.4,50.02 D5.A 28.58,50.18 29.42,50.18 v29.48,50.24
  Route15 0.61: 9.25,52.25 v9.23,52.27 14.88,52.27 16.5,50.65 29.09,50.65 29.48,50.26 v29.48,50.24
  Bottom 0.406: v9.23,52.27 8.49,52.27 8.45,52.23 R14.2
N$21
  Bottom 0.305: 6.46,52.04 6.46,51.85 T2.C
  Bottom 0.406: R14.1 6.46,52.04
N$22
  Bottom 0.61: 5.78,55.52 5.48,55.52 F2.2 | D3.A 8.64,53.76 8.5,53.9
  Bottom 0.813: 7.4,53.9 8.5,53.9 8.65,53.9 | 5.78,55.52 5.78,54.95 6.77,53.96 8.18,53.96 D3.A
N$23
  Bottom 0.813: 21.49,40.2 21.42,40.27 JP6.2
  Bottom 1.27: 25.7,40.2 25.7,40.7 28.65,43.65 SJ3.2 | 25.7,40.2 25.7,31.5 | 25.7,31.5 25.7,23.5 | 25.7,23.5 25.7,15.2 24.2,13.7 21.49,13.7 JP14.2 | 25.7,23.5 25.47,23.27 21.92,23.27 JP11.2 | JP9.2 25.43,31.77 25.7,31.5 | 21.49,40.2 25.7,40.2
N$24
  Top 0.61: Q3.1 35.92,25.22 35.3,24.6 R25.1
N$26
  Top 0.305: U4.VBUS 7.73,53.52 7.79,53.58 8.05,53.58 | 8.05,53.58 8.26,53.58 8.29,53.55 8.29,53.16 8.29,52.84 7.86,52.84 7.86,53.3 7.9,53.34 7.9,53.22 8.06,53.06 8.06,53.57 8.05,53.58 | 8.05,53.58 8.05,53.57 8.26,53.36
  Top 0.813: 8.29,53.16 9.26,54.13 12,54.13 13,55.13 F1.2
N$27
  Top 0.406: C2.1 10.56,52.26 arc45 10.33,52.17 C1.1
  Top 0.813: C2.1 11.75,52.29 F1.1 14.68,53.27 arc45 14.73,53.41 15.65,53.41 SJ1.2
N$28
  Bottom 0.406: U2.14 10.35,51.1
  Bottom 0.61: R12.2 10.11,51.4 R9.1 10.55,51.1 10.35,51.1
N$29
  Top 0.61: 32.2,22.79 32.2,23.39 Q3.3
  Top 0.813: 32.2,22.79 32.2,15.51 D6.A 32.39,13.66 SPK1.+
N$30
  Bottom 0.61: C5.+ 33.6,49.3 34.19,48.71 34.19,47.72 T1.2
  Bottom 1.27: C5.+ 30.86,49.3 AZ1084C1.VIN
N$31  (via drill 0.5)
  Top 0.406: IC1.13 22.53,14.46 22.53,14.3 | 22.04,14.66 IC1.14 22.04,14.54 22,14.5 22.57,14.5 IC1.13 | IC1.24 15.54,15.21 v14.96,15.79 | 22.43,14.17 22.43,14.36 IC1.13 | 22.38,15.07 22.38,14.92 IC1.13
  Top 0.61: IC1.13 23.39,13.9 | 23.39,13.9 24,13.3 C21.2 | C20.1 24.43,13.9 23.39,13.9
  Top 0.813: 22.37,15.06 22.38,15.07 23.18,15.87 v23.18,16.06
  Route2 1.27: v23.18,16.06 22.86,16.38 22.86,20.78 21.4,22.24 21.4,44.26 v17.97,47.69
  Bottom 0.813: v23.18,16.06 23.1,15.98 23.1,15.5 22.7,15.1 15.16,15.1 15,15.26 15,15.75 v14.96,15.79 | v17.97,47.69 16.69,47.69 16.12,47.12 16.12,45.82 SJ4.2
N$43
  Top 0.305: R20.1 5.92,15.85 arc-45 5.89,15.78
  Top 0.406: 5.89,15.78 5.89,13.08 5.85,13.04 SK-12C04051.L
RD_N
  Top 0.127: ATMEGA32U41.3 9.47,39.91 8.73,40.65 8.73,42.35 6.03,45.05 6.03,46.96 R1.2
RD_P
  Top 0.127: ATMEGA32U41.4 9.3,39.72 8.47,40.55 8.47,42.25 5.77,44.95 5.77,46.94 R3.2
RESET
  Top 0.254: ATMEGA32U41.13 6.85,35.3 4.7,35.3 4.12,35.88 R15.2
  Top 0.3: R15.2 4.12,36.28 4,36.4
  Top 0.406: 4,36.4 4,38.3 3.2,39.1 2.2,39.1 1.4,39.9 1.4,41 2.1,41.7 4,41.7 5.18,42.88 JP4.5 | KMR1.P$4 arc-45 3.92,46.26 3.92,47.18 2.8,48.3 2.8,49.4 3.89,50.49 arc45 3.98,50.72 KMR1.P$3 arc45 3.9,51.09
  Top 0.61: JP4.5 5.18,43.32 3.92,44.58 3.92,45.94 arc-45 KMR1.P$4
RXLED/SS
  Top 0.254: ATMEGA32U41.8 6.31,39.72 6.31,41.12 6.75,41.56 R17.1
SCK  (via drill 0.25)
  Top 0.254: ATMEGA32U41.9 5.18,40.14 JP4.3 | 27.4,27.3 v27.3,27.4
  Top 0.406: R27.2 27.45,27.25 v27.3,27.4
  Route15 0.61: 7.66,38.31 6.89,38.31 5.64,39.56 5.64,39.99 JP4.3
  Route15 0.813: v27.3,27.4 27.3,37.94 23.03,42.21 | 23.03,42.21 23.02,42.2 | 23.03,42.21 22.75,42.49 13.1,42.49 8.92,38.31 7.66,38.31
SCL_3V
  Top 0.254: 15.36,24.04 15.42,24.04 | 15.42,24.04 MPU-60501.23 | R22.1 15.42,24.04
  Top 0.406: Q2.2 8.6,25.05 8.6,25.7 8.9,26 13,26 14.96,24.04 15.36,24.04
SCL_5V
  Top 0.254: ATMEGA32U41.18 8.29,33.21 7.8,32.72 7.8,31.9
  Top 0.406: Q2.3 7.8,27.1 7.8,28.5 | 7.8,28.5 7.8,31.9 | R24.1 7.8,28.5
SDA_3V
  Top 0.254: MPU-60501.24 13.08,23.53
  Top 0.406: 12.35,24.55 Q1.2
  Top 0.61: 12.35,24.55 12.11,24.31 R21.1 12.15,23.53 13.08,23.53
SDA_5V
  Top 0.254: ATMEGA32U41.19 8.5,32.71 8.5,30.4
  Top 0.406: 8.5,30.4 8.5,28.9 10.1,27.3 11.1,27.3 Q1.3 11.7,27.3 R23.1
STBY  (via drill 0.25)
  Top 0.406: v18.89,12.7 18.79,12.8 IC1.19 | 6.14,10.01 v6.14,11.46
  Top 0.61: SK-12C04051.M 6.11,10.04 6.14,10.01
  Bottom 0.61: v18.89,12.7 18.69,12.5 6.5,12.5 6.14,12.14 v6.14,11.46
UCAP
  Top 0.254: C19.1 6.97,40.37 7.29,40.05 7.63,40.05 7.97,39.71 7.97,39.62 8.27,39.32 8.27,39.17 ATMEGA32U41.6
V+  (via drill 0.4, 0.65)
  Top 0.61: v29.48,57.12 29.75,57.12 30.08,56.79 30.08,55.19 | 30.08,55.19 30.09,55.18 | 30.08,55.19 CN1.1
  Top 1.016: 35.66,50.01 ON_OFF_SLIDE1.P$3 31.09,50.11 30.08,51.12 CN1.1
  Route15 1.27: ON_OFF_SLIDE1.P$3 33.31,50.1 32.31,49.1 13.9,49.1 12.1,50.9 5.8,50.9 v3.9,49
  Bottom 0.61: U1.3 | U1.3 v3.9,49
  Bottom 1.016: U$1.P$1 28.83,56.47 v29.48,57.12
VBAT  (via drill 0.45)
  Bottom 0.406: v7.3,48.2 7.45,48.34
  Bottom 0.61: T2.E 5.45,49.15 6.4,48.2 v7.3,48.2
VDD  (via drill 0.52, 0.71, 1)
  Top 0.61: T3.3 21.18,53.22 22.46,54.5
  Top 1.016: X1.2 22.46,54.5 22.46,54.17 23.72,52.91 25.37,52.91 R11.2
  Route2 0.813: v2.13,44.76 6.21,44.76 arc-45 6.43,44.67 7.6,43.5
  Route2 1.016: 7.6,43.5 16.4,43.5 v17.08,44.18
  Route2 1.27: v30.88,43.46 30.7,43.46 29.56,44.6 29.56,48.05 22.48,55.13 22.48,55.96 X1.2
  Route15 1.27: v17.08,44.18 30.16,44.18 v30.88,43.46
  Bottom 0.305: v17.08,44.18 arc-45 17.03,44.2 17,44.23
  Bottom 0.61: T1.1 33.26,44.2 32.49,43.43
  Bottom 0.813: SJ3.3 30.17,44.17 v30.88,43.46 30.91,43.43 32.49,43.43
  Bottom 1.016: SJ2.3 1.88,45.01 v2.13,44.76 | SJ4.3 14.58,44.63 14.98,44.23 17,44.23 17.03,44.23
VOUT1
  Bottom 0.305: 10.8,54.3 10.8,54.7 10.5,55 11,55 10.93,54.92 10.8,54.92 | 10.1,53 10.03,53.07 10.03,54.51 10.18,54.51 10.17,54.5 10.17,53.59 10.18,53.58 10.38,53.58 10.35,53.61 10.35,54.49 10.27,54.57 10.27,55.02 10.11,55.18 10.11,55.48 10.09,55.5 10.09,55.51 10.1,55.5
  Bottom 0.406: 11.64,51.3 R9.2 11.96,51.61 C3.1 | 12.38,50.12 U2.16 11.64,52.26 11.6,52.3 11.6,50.6 11.8,50.4 11.8,51.3 12.2,51.3 12.2,50.5 12,50.3 12,51.4 12.1,51.5 12.1,50.4 12.38,50.12 | 12.38,50.12 12.6,49.9 | 12.6,49.9 12.8,49.7 12.8,49.02 U2.1 | 12.6,49.9 12.6,49.2 13,49.2 13.1,49.1 13.1,49.8 12.6,50.3 11.8,50.3 11.6,50.1 11.02,50.1 U2.15 | 11,55.6 11.6,56.2 11.6,56.3 | 9.4,56.3 9.4,55.55 9.4,55.5 | 9.4,55.5 9.4,54.9 | 9.4,54.9 9.3,54.9 | 9.4,54.9 9.7,54.9 | 9.7,56.1 9.7,54.9 | 9.7,54.9 9.8,54.9 9.8,55.2 10.1,55.5 | 10.1,53 10.4,53 | 10.5,53.9 11.6,53.9 11.6,53.1 11.7,53.1 11.7,53.7 11.3,53.7 11.3,54.8 10.6,54.8 10.6,54.7 9.9,54.7 9.9,55.5 9.5,55.5 9.4,55.5
  Bottom 0.813: C3.1 11.6,52.7 10.9,53.4 10.9,54.2 10.8,54.3 | F2.1 9.29,55.71 9.41,55.59 | 9.41,55.59 9.5,55.5 9.45,55.5 | 8.5,55.5 9.45,55.5 | 9.45,55.5 9.4,55.55 9.47,55.55 9.49,55.57 9.47,55.57 9.41,55.51 9.41,55.59 | 11,55 10.96,55 10.02,55.94 9.72,55.94 9.59,56.07 9.68,56.16 10.75,56.16 10.79,56.2 11.6,56.2
  pour Bottom: 11.6,50 12.6,50.1 12.6,49.1 13.2,49.1 13.2,51.5 12,51.5 12,56.3 7.8,56.3 7.8,54.9 10,54.9 10,52.4 11.6,52.4
VUSB  (via drill 0.25, 0.45)
  Top 0.254: ATMEGA32U41.7 7.5,39.24 v7.5,39.4
  Top 0.406: VUSB.TP 1.37,52.91 arc-45 1.59,53 v2.3,53
  Top 0.61: v18.01,55.4 18.25,55.16 T3.1 | v18.01,55.4 17.95,55.46 | v18.01,55.4 17.99,55.38 16.1,55.38 SJ1.3
  Route2 1.016: v18.01,55.4 17.69,55.08 3.81,55.08 2.3,53.57 v2.3,53
  Route15 0.61: v7.5,39.4 7.63,39.53 7.58,39.58 7.58,46.4 6.68,47.3 3.6,47.3 2.3,48.6 v2.3,53
  Route15 0.813: 2.3,52.61 v2.3,53
  Bottom 0.61: 2.3,53.1 2.3,53.18 2.91,53.79 4.65,53.79 D3.C | 4.89,53.72 4.89,53.55 D3.C | 4.8,53.77 4.8,53.64 D3.C
  Bottom 0.813: 2.3,53.1 v2.3,53
XTAL1
  Top 0.254: ATMEGA32U41.17 7.36,32.99 6.19,31.81 | X3.3 7.04,30.6 C16.2
  Top 0.305: 6.19,31.81 X3.3
XTAL2
  Top 0.254: ATMEGA32U41.16 7.77,34.1 6.27,32.6 5.7,32.6 4.88,31.77 X3.1 2.49,32.55
  Top 0.305: C15.2 | C15.2 2.49,32.55

## Text on the board
tPlace: SJ1 | B | +VIN- | CRG | GND | FULL | LOW | RST | POW | G 5V A0 | D0 5V G | X | G 5V A1 | D1 5V G | Y | Z | BT | RX | L | G 5V A2 | 3V3 | ebots.cc | D2 5V G | RGB1 | RGB2 | RGB3 | RGB4 | D3 | 1 | A3 | EN | + | + | 0 | M_EN | SW1 | SW2 | RM | LM | - | - | CBITS.CC | 4
bPlace: -BAT+ | 7-12V | VIN | 5V | SJ_M | SJ_IN | 5V | SJ_OUT | 5V | A0 5V G | G 5V D0 | A1 5V G | cbits.cc | G 5V D1 | A2 5V G | G 5V D2 | A3 5V G | G 5V D3 | + | + | LEFT MOTOR | RIGHT MOTOR | - | -